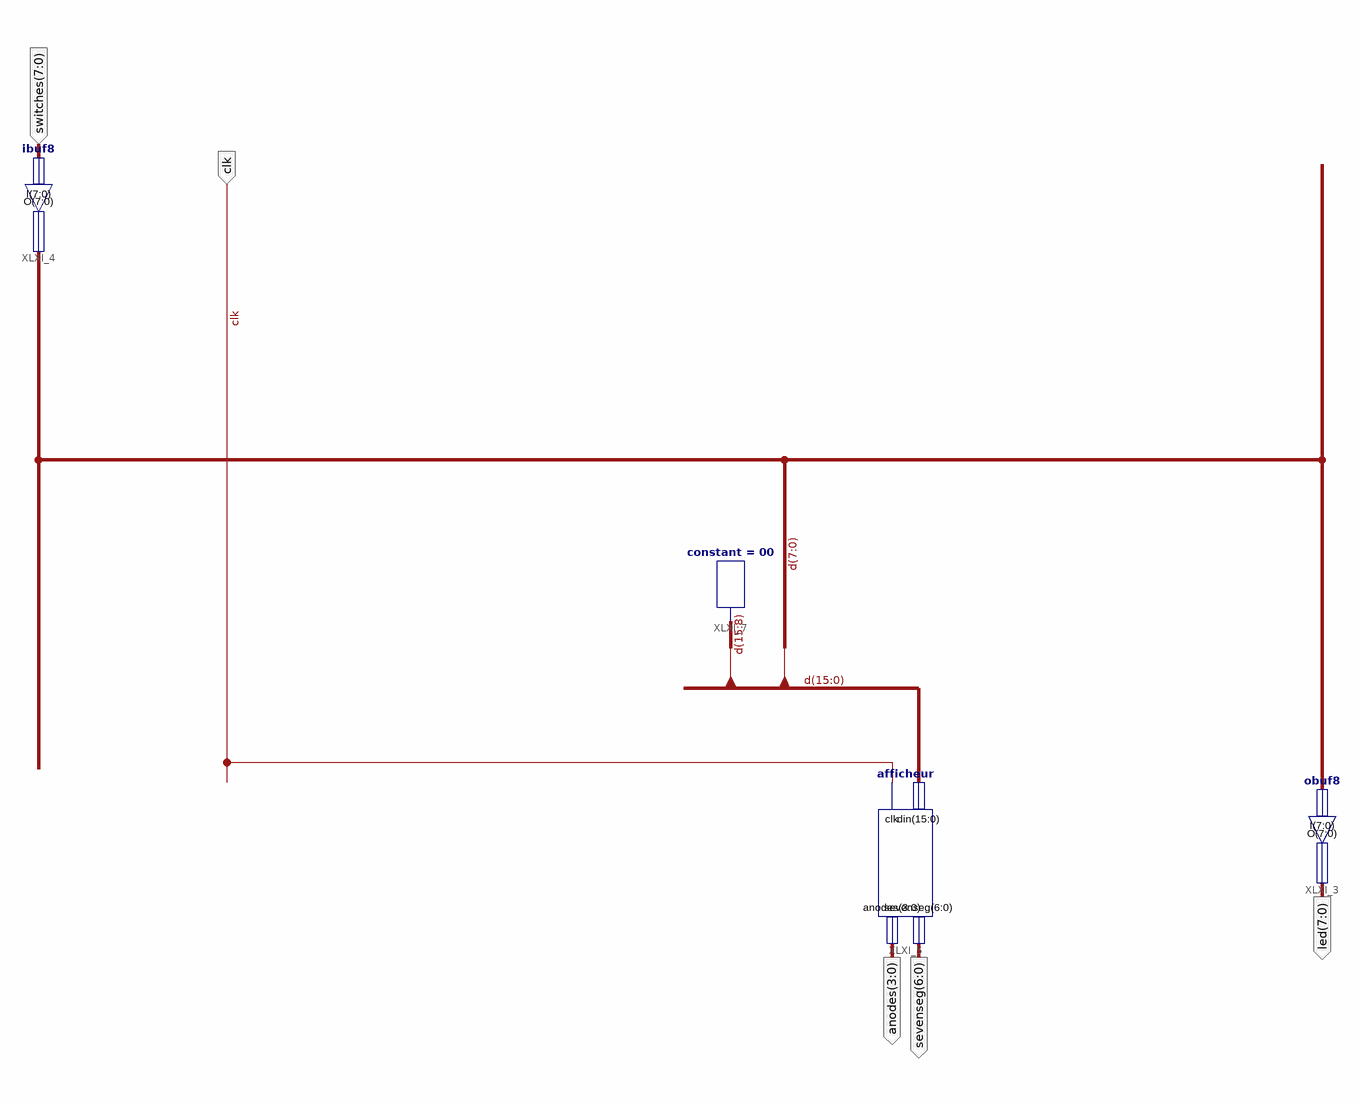
[diagram p0: schematic sheet 1]
// Xilinx ISE schematic toplevel.sch (spartan6) as structural Verilog: 4 symbols, 5 ports
module toplevel (
  input  [7:0] switches,
  input  clk,
  output [7:0] led,
  output [3:0] anodes,
  output [6:0] sevenseg
);

  wire [15:0] d;

  obuf8 XLXI_3 (.I(d[7:0]), .O(led));
  ibuf8 XLXI_4 (.I(switches), .O(d[7:0]));
  afficheur XLXI_5 (.din(d), .clk(clk), .sevenseg(sevenseg), .anodes(anodes));
  constant #(.CValue("00")) XLXI_7 (.O(d[15:8]));
endmodule
